# EAGLE design object01 (EAGLE 7.5.0)
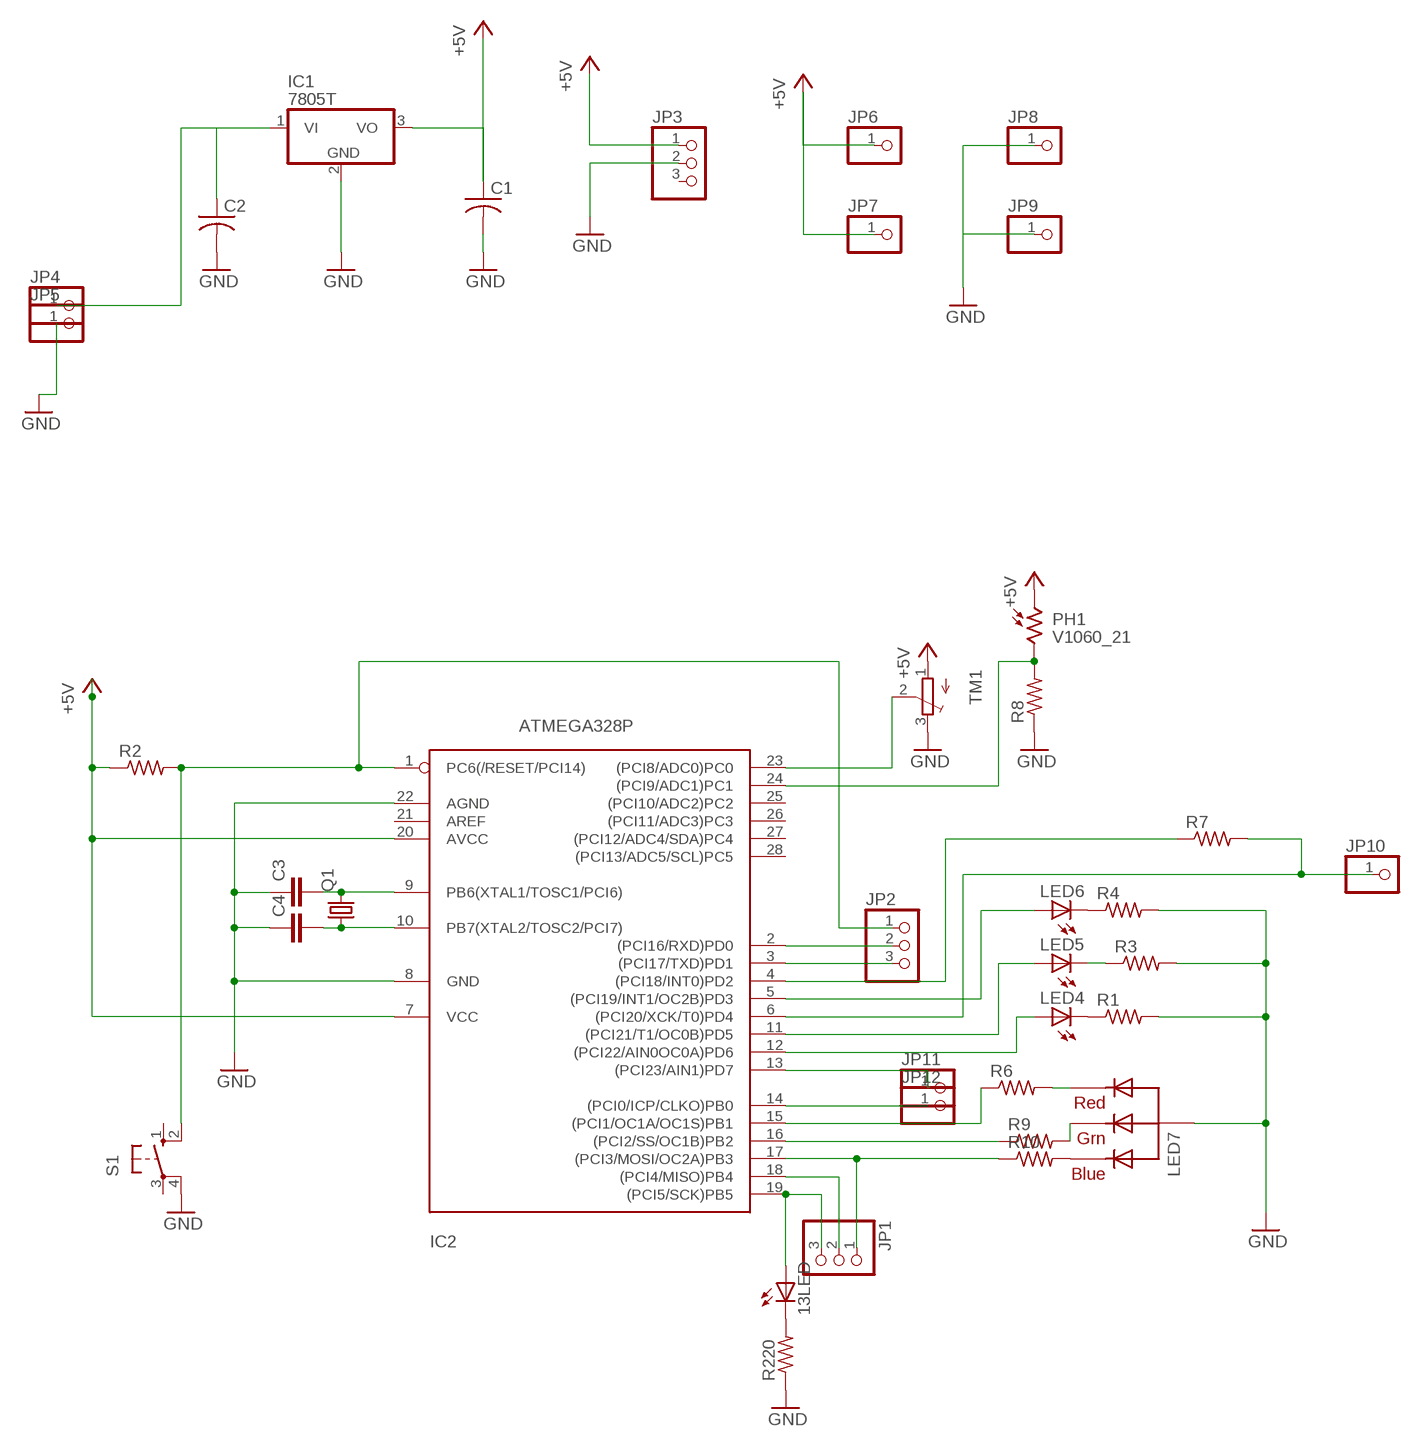
[diagram p0: schematic, sheet 1]

## Parts
13LED  LED5MM  [LED5MM]
C1  C-US050-024X044  [C050-024X044]
C2  C-US050-024X044  [C050-024X044]
C3  C-EU025-024X044  [C025-024X044]
C4  C-EU025-024X044  [C025-024X044]
IC1  7805T  [TO220H]
IC2  ATMEGA328P  [DIL28-3]
JP1  PINHD-1X3CB  [1X03-CLEANBIG]
JP2  PINHD-1X3CB  [1X03-CLEANBIG]
JP3  PINHD-1X3CB  [1X03-CLEANBIG]
JP4  PINHD-1X1  [1X01]
JP5  PINHD-1X1  [1X01]
JP6  PINHD-1X1  [1X01]
JP7  PINHD-1X1  [1X01]
JP8  PINHD-1X1  [1X01]
JP9  PINHD-1X1  [1X01]
JP10  PINHD-1X1  [1X01]
JP11  PINHD-1X1  [1X01]
JP12  PINHD-1X1  [1X01]
LED4  LED5MM  [LED5MM]
LED5  LED5MM  [LED5MM]
LED6  LED5MM  [LED5MM]
LED7  RGBLED_CA-5MM  [LED5MMRGB]
PH1  V1060_21  [TO-5_V10]
Q1  CRYSTALHC49U-V  [HC49U-V]
R1  R-US_0207/10  [0207/10]
R2  R-US_0204/5  [0204/5]
R3  R-US_0207/10  [0207/10]
R4  R-US_0207/10  [0207/10]
R6  R-US_0207/10  [0207/10]
R7  R-US_0207/10  [0207/10]
R8  R-US_0207/10  [0207/10]
R9  R-US_0207/10  [0207/10]
R10  R-US_0207/10  [0207/10]
R220  R-US_0207/10  [0207/10]
S1  10-XX  [B3F-10XX]
TM1  TRIMPOT3386  [TRIM-3386]

## Nets
+5V: C1.1 IC1.3(VO) IC2.7(VCC) IC2.20(AVCC) JP3.1 JP6.1 JP7.1 PH1.1 R2.1 TM1.1(A)
GND: C1.2 C2.2 C3.1 C4.1 IC1.2(GND) IC2.8(GND) IC2.22(AGND) JP3.2 JP5.1 JP8.1 JP9.1 LED7.2(VCC) R1.2 R3.2 R4.2 R8.1 R220.1 S1.4(P1) TM1.3(E)
N$1: C2.1 IC1.1(VI) JP4.1
N$2: C3.2 IC2.9(PB6(XTAL1/TOSC1/PCI6)) Q1.2
N$3: C4.2 IC2.10(PB7(XTAL2/TOSC2/PCI7)) Q1.1
N$4: IC2.17((PCI3/MOSI/OC2A)PB3) JP1.1 R10.1
N$5: IC2.18((PCI4/MISO)PB4) JP1.2
N$6: 13LED.A IC2.19((PCI5/SCK)PB5) JP1.3
N$7: IC2.2((PCI16/RXD)PD0) JP2.2
N$8: IC2.3((PCI17/TXD)PD1) JP2.3
N$9: IC2.1(PC6(/RESET/PCI14)) JP2.1 R2.2 S1.2(S1)
N$10: LED7.1(RED) R6.2
N$11: LED7.3(GREEN) R9.2
N$12: LED5.K(C) R3.1
N$13: LED4.K(C) R1.1
N$14: LED6.K(C) R4.1
N$16: IC2.14((PCI0/ICP/CLKO)PB0) JP12.1
N$17: IC2.5((PCI19/INT1/OC2B)PD3) LED6.A
N$18: IC2.11((PCI21/T1/OC0B)PD5) LED5.A
N$19: IC2.12((PCI22/AIN0OC0A)PD6) LED4.A
N$20: IC2.23((PCI8/ADC0)PC0) TM1.2(S)
N$21: IC2.24((PCI9/ADC1)PC1) PH1.2 R8.2
N$22: IC2.13((PCI23/AIN1)PD7) JP11.1
N$23: IC2.4((PCI18/INT0)PD2) R7.1
N$24: IC2.6((PCI20/XCK/T0)PD4) JP10.1 R7.2
N$25: LED7.4(BLUE) R10.2
N$26: 13LED.K(C) R220.2
N$27: IC2.15((PCI1/OC1A/OC1S)PB1) R6.1
N$28: IC2.16((PCI2/SS/OC1B)PB2) R9.1
Unconnected: IC2.21(AREF) IC2.25((PCI10/ADC2)PC2) IC2.26((PCI11/ADC3)PC3) IC2.27((PCI12/ADC4/SDA)PC4) IC2.28((PCI13/ADC5/SCL)PC5) JP3.3 S1.1(S) S1.3(P)

## Library data of the parts
13LED LED4-LED6 = led:LED: LED OSRAM: - CHIPLED LG R971, LG N971, LY N971, LG Q971, LY Q971, LO R971, LY R971 LH N974, LH R974 LS Q976, LO Q976, LY Q976 LO Q996 - Hyper CHIPLED LW Q18S LB Q993, LB Q99A, LB R99A - SideLED LS A670, LO A670, LY A670, LG A670, LP A670 LB A673, LV A673, LT A673, LW A673 LH A674 LY A675 LS A676, LA A676, LO A676, LY A676, LW A676 LS A679, LY A679, LG A679 - Hyper Micro SIDELED® LS Y876, LA Y876, LO Y876, LY Y876 LT Y87S - SmartLED LW L88C, LW L88S LB L89C, LB L89S, LG L890 LS L89K, LO L89K, LY L89K LS L896, LA L896, LO L896, LY L896 - TOPLED LS T670, LO T670, LY T670, LG T670, LP T670 LSG T670, LSP T670, LSY T670, LOP T670, LYG T670 LG T671, LOG T671, LSG T671 LB T673, LV T673, LT T673, LW T673 LH T674 LS T676, LA T676, LO T676, LY T676, LB T676, LH T676, LSB T676, LW T676 LB T67C, LV T67C, LT T67C, LS T67K, LO T67K, LY T67K, LW E67C LS E67B, LA E67B, LO E67B, LY E67B, LB E67C, LV E67C, LT E67C LW T67C LS T679, LY T679, LG T679 LS T770, LO T770, LY T770, LG T770, LP T770 LB T773, LV T773, LT T773, LW T773 LH T774 LS E675, LA E675, LY E675, LS T675 LS T776, LA T776, LO T776, LY T776, LB T776 LHGB T686 LT T68C, LB T68C - Hyper Mini TOPLED® LB M676 - Mini TOPLED Santana® LG M470 LS M47K, LO M47K, LY M47K Source: http://www.osram.convergy.de LUXEON: - LUMILED® LXK2-PW12-R00, LXK2-PW12-S00, LXK2-PW14-U00, LXK2-PW14-V00 LXK2-PM12-R00, LXK2-PM12-S00, LXK2-PM14-U00 LXK2-PE12-Q00, LXK2-PE12-R00, LXK2-PE12-S00, LXK2-PE14-T00, LXK2-PE14-U00 LXK2-PB12-K00, LXK2-PB12-L00, LXK2-PB12-M00, LXK2-PB14-N00, LXK2-PB14-P00, LXK2-PB14-Q00 LXK2-PR12-L00, LXK2-PR12-M00, LXK2-PR14-Q00, LXK2-PR14-R00 LXK2-PD12-Q00, LXK2-PD12-R00, LXK2-PD12-S00 LXK2-PH12-R00, LXK2-PH12-S00 LXK2-PL12-P00, LXK2-PL12-Q00, LXK2-PL12-R00 Source: www.luxeon.com KINGBRIGHT: KA-3528ASYC Source: www.kingbright.com
C1 C2 = rcl:C-US: CAPACITOR, American symbol
C3 C4 = rcl:C-EU: CAPACITOR, European symbol
IC1 = adafruit:78*: Positive VOLTAGE REGULATOR Added bigger pads to the TO-92 package
IC2 = nanino2:ATMEGA328P
JP1-JP3 = adafruit:PINHD-1X3: PIN HEADER
JP4-JP12 = adafruit:PINHD-1X1: Pin header 1x1 for 0.1" spacing With round pins
LED7 = adafruit:RGBLED_CA: RGB LED, common-anode 5MM Staggered pins 5mm Piranha package http://www.ladyada.net/library/pcb/eaglelibrary.html
PH1 = photo-elements:?1060*: Sensor Street Light control Source: http://optoelectronics.perkinelmer.com/content/Datasheets/DTS_PhotocellsB1060.pdf
Q1 = adafruit:CRYSTAL: CRYSTAL; OC_FARNELL: 1666969; OC_NEWARK: unknown
R1-R4 R6-R10 R220 = resistor:R-US_: RESISTOR, American symbol
S1 = switch-omron:10-XX: OMRON SWITCH; MPN: B3F-1000; OC_FARNELL: 176432; OC_NEWARK: 36M3542
TM1 = adafruit:TRIMPOT: SMT trimmer potentiometer part number TC33X http://www.ladyada.net/library/eagle

## Board
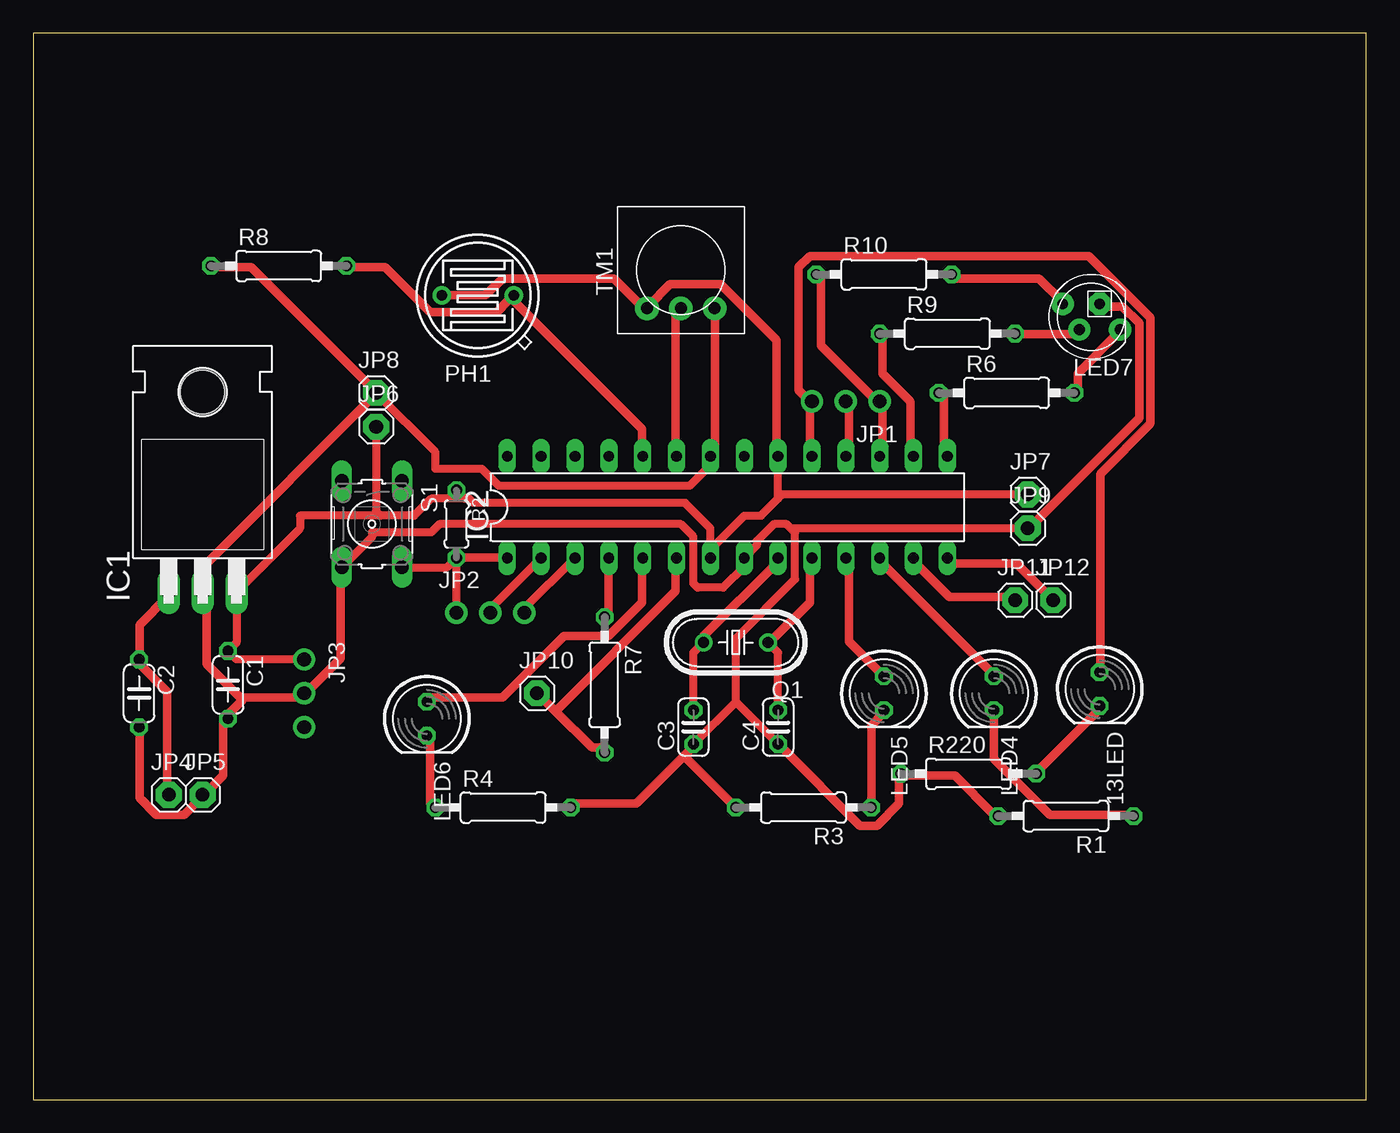
[diagram p1: board, top side]

Size 100 x 80 mm. Coordinates in mm from the lower left corner, seen from the top.
Outline: 0,0 100,0 100,80 0,80 0,0
Copper layers 1: Top 0.035mm
Design rules "default *": minimum track width 25mil, minimum drill 24mil, track to track 8mil, track to pad 8mil, pad to pad 8mil, via to via 8mil, smd to smd 8mil, copper to edge 40mil, drill to drill 12mil, minimum pad ring 10mil, minimum via ring 8mil, stop-mask expansion 4mil, vias tented up to drill 0mil, thermal gap 10mil

### Footprints (pad centres in the part's own frame; a part is rotated, then mirrored left to right if it is on the bottom)
LED5MM = drill 0.813 octagon: A -1.27,0; K 1.27,0
C050-024X044 = drill 0.813 octagon: 1 -2.54,0; 2 2.54,0
C025-024X044 = drill 0.813 octagon: 1 -1.27,0; 2 1.27,0
TO220H = drill 1.118 long: 1 -2.54,-10.16; 2 0,-10.16; 3 2.54,-10.16 | hole 3.302: 0,4.826
DIL28-3 = drill 0.813 long: 1 -16.51,-3.81; 2 -13.97,-3.81; 3 -11.43,-3.81; 4 -8.89,-3.81; 5 -6.35,-3.81; 6 -3.81,-3.81; 7 -1.27,-3.81; 8 1.27,-3.81; 9 3.81,-3.81; 10 6.35,-3.81; 11 8.89,-3.81; 12 11.43,-3.81; 13 13.97,-3.81; 14 16.51,-3.81; 15 16.51,3.81; 16 13.97,3.81; 17 11.43,3.81; 18 8.89,3.81; 19 6.35,3.81; 20 3.81,3.81; 21 1.27,3.81; 22 -1.27,3.81; 23 -3.81,3.81; 24 -6.35,3.81; 25 -8.89,3.81; 26 -11.43,3.81; 27 -13.97,3.81; 28 -16.51,3.81
1X03-CLEANBIG = drill 1.016 pad 1.676: 1 -2.54,0; 2 0,0; 3 2.54,0
1X01 = drill 1.016 pad 1.93 octagon: 1 0,0
LED5MMRGB = drill 0.8 pad 1.676: 1 -2.159,0.968; 3 0.889,0.968; 4 2.159,-0.968 | drill 0.8 pad 1.676 octagon: 2 -0.635,-0.968
TO-5_V10 = drill 0.8 pad 1.4: 1 -2.7,0; 2 2.7,0
HC49U-V = drill 0.813: 1 -2.413,0; 2 2.413,0
0207/10 = drill 0.813 octagon: 1 -5.08,0; 2 5.08,0
0204/5 = drill 0.813 octagon: 1 -2.54,0; 2 2.54,0
B3F-10XX = drill 1.016 long: 1 -3.251,2.261; 2 3.251,2.261; 3 -3.251,-2.261; 4 3.251,-2.261
TRIM-3386 = drill 0.9 pad 1.778: 1 -2.54,-2.857; 2 0,-2.857; 3 2.54,-2.857

### Placement (x,y rotation side)
13LED  80.01,30.8 270 top
C1  14.61,31.11 270 top
C2  7.94,30.48 270 top
C3  49.53,27.94 90 top
C4  55.88,27.94 90 top
IC1  12.7,48.26 0 top
IC2  52.07,44.45 0 top
JP1  60.96,52.39 180 top
JP2  34.29,36.51 0 top
JP3  20.32,30.48 270 top
JP4  10.16,22.86 0 top
JP5  12.7,22.86 0 top
JP6  25.72,50.48 0 top
JP7  74.61,45.4 0 top
JP8  25.72,53.02 0 top
JP9  74.61,42.86 0 top
JP10  37.78,30.48 0 top
JP11  73.66,37.47 0 top
JP12  76.52,37.47 0 top
LED4  72.07,30.48 270 top
LED5  63.82,30.48 270 top
LED6  29.53,28.57 270 top
LED7  79.38,58.74 180 top
PH1  33.34,60.33 0 top
Q1  52.7,34.29 180 top
R1  77.47,21.27 180 top
R2  31.75,43.18 270 top
R3  57.78,21.91 180 top
R4  35.24,21.91 0 top
R6  73.03,53.02 0 top
R7  42.86,31.11 270 top
R8  18.41,62.55 0 top
R9  68.58,57.47 0 top
R10  63.82,61.91 0 top
R220  70.17,24.45 0 top
S1  25.4,43.18 270 top
TM1  48.58,62.23 0 top

### Tracks (layer width: path | path; a pad name or v marks a point on that pad's centre or on a via)
+5V
  Top 0.61: IC2.7 50.8,41.27 | 50.8,41.27 53.34,43.81 54.61,43.81 55.88,45.09 | 55.88,45.09 IC2.20 | 50.8,41.27 50.8,42.86 48.9,44.77 33.02,44.77 32.7,45.09 32.38,45.09 | 32.38,45.09 R2.1 | 32.38,45.09 29.84,45.09 28.57,43.81 26.04,43.81 | 26.04,43.81 20,43.81 20,42.86 IC1.3 15.24,34.29 C1.1 15.24,33.02 JP3.1 | JP6.1 25.72,44.13 26.04,43.81 | JP7.1 56.2,45.4 55.88,45.09
  Top 0.635: 50.71,40.65 IC2.7 | PH1.1 31.01,60.35 33.95,60.35 35.2,61.61 43.59,61.61 45.68,59.51 TM1.1 46.1,59.51 47.78,61.19 51.55,61.19 55.74,57 55.74,48.62 IC2.20
GND
  Top 0.61: IC2.22 50.8,47.62 49.21,46.04 34.92,46.04 33.66,47.31 30.16,47.31 30.16,48.58 JP8.1 | JP3.2 20.32,30.16 | C3.1 52.7,29.84 | 52.7,29.84 52.7,34.61 57.15,39.05 57.15,42.55 56.83,42.86 | S1.4 25.4,42.19 25.4,42.55 29.84,42.55 30.48,43.18 48.58,43.18 49.53,42.23 49.53,38.73 49.85,38.42 51.75,38.42 53.34,40.01 IC2.8 54.29,41.59 54.29,41.91 55.56,43.18 56.52,43.18 56.83,42.86 | C4.1 52.7,29.84 | JP9.1 56.83,42.86
  Top 0.635: 15.72,29.97 14.67,28.92 C1.2 14.25,28.5 14.25,24.31 12.99,23.05 JP5.1 12.57,22.63 11.32,21.37 9.22,21.37 7.96,22.63 7.96,27.66 C2.2 | 15.72,29.97 15.93,30.18 20.12,30.18 JP3.2 20.54,30.59 23.05,33.11 23.05,39.81 S1.4 | 15.72,29.97 12.99,32.69 12.99,37.72 IC1.2 12.99,38.14 12.99,40.23 25.57,52.81 JP8.1 25.57,53.23 16.34,62.45 13.41,62.45 R8.1 | R1.2 72.08,21.37 69.15,24.31 65.38,24.31 R220.1 64.96,24.31 64.96,22.21 63.28,20.54 62.03,20.54 56.16,26.4 C4.1 | 48.83,25.77 49.45,26.4 C3.1 | 48.83,25.77 45.26,22.21 40.65,22.21 R4.2 | 48.83,25.77 52.39,22.21 R3.2 | TM1.3 51.13,59.09 51.13,48.62 IC2.22 | LED7.2 80.05,59.51 81.72,59.51 82.98,58.26 82.98,51.13 75.02,43.17 JP9.1
N$1
  Top 0.635: IC1.1 10.06,37.72 7.96,35.62 7.96,33.11 C2.1 7.96,32.69 10.06,30.59 10.06,23.05 JP4.1
N$2
  Top 0.61: C3.2 49.53,33.53 Q1.2
  Top 0.635: Q1.2 50.29,34.78 55.74,40.23 IC2.9
N$3
  Top 0.61: C4.2 55.88,33.53 Q1.1
  Top 0.635: IC2.10 58.26,40.23 58.26,37.3 55.32,34.37 Q1.1
N$4
  Top 0.635: IC2.17 63.7,48.62 63.7,52.39 JP1.1 63.28,52.39 59.09,56.58 59.09,61.61 R10.1
N$5
  Top 0.635: IC2.18 61.19,48.62 61.19,52.39 JP1.2
N$6
  Top 0.635: 58.26,52.39 58.26,48.62 IC2.19 | 58.26,52.39 57.42,53.23 57.42,62.45 58.26,63.28 79.21,63.28 83.82,58.67 83.82,50.71 80.05,46.94 80.05,32.27 13LED.A | 58.26,52.39 JP1.3
N$7
  Top 0.61: JP2.2 34.29,36.83 IC2.2
N$8
  Top 0.61: JP2.3 36.83,36.83 IC2.3
N$9
  Top 0.61: JP2.1 R2.2 31.04,39.93 S1.2
  Top 0.635: IC2.1 35.2,40.65 31.85,40.65 R2.2
N$10
  Top 0.635: R6.2 78.37,53.23 78.37,54.48 81.31,57.42 LED7.1
N$11
  Top 0.635: R9.2 73.76,57.42 78.37,57.42 LED7.3
N$12
  Top 0.635: R3.1 62.87,28.08 63.7,28.92 LED5.K
N$13
  Top 0.635: R1.1 82.14,21.37 76.28,21.37 72.08,25.57 72.08,28.92 LED4.K
N$14
  Top 0.635: LED6.K 29.76,27.24 29.76,22.21 R4.1
N$16
  Top 0.635: IC2.14 68.73,40.23 73.76,40.23 76.28,37.72 JP12.1
N$17
  Top 0.635: LED6.A 29.76,30.18 35.2,30.18 39.81,34.78 43.17,34.78 45.68,37.3 45.68,40.23 IC2.5
N$18
  Top 0.635: IC2.11 61.19,40.23 61.19,34.37 63.7,31.85 LED5.A
N$19
  Top 0.635: IC2.12 63.7,40.23 72.08,31.85 LED4.A
N$20
  Top 0.635: IC2.23 48.2,48.62 48.2,59.09 TM1.2
N$21
  Top 0.635: IC2.24 45.68,48.62 45.68,50.29 36.04,59.93 PH1.2 35.62,59.93 34.78,59.09 29.76,59.09 26.4,62.45 23.89,62.45 R8.2
N$22
  Top 0.635: IC2.13 66.22,40.23 68.73,37.72 73.34,37.72 JP11.1
N$23
  Top 0.635: R7.1 43.17,36.46 43.17,40.23 IC2.4
N$24
  Top 0.635: 39.19,29.13 38.14,30.18 JP10.1 | 39.19,29.13 41.91,26.4 42.75,26.4 R7.2 | 39.19,29.13 48.2,38.14 48.2,40.23 IC2.6
N$25
  Top 0.635: R10.2 69.15,61.61 75.44,61.61 77.11,59.93 LED7.4
N$26
  Top 0.635: R220.2 75.44,24.73 80.05,29.34 13LED.K
N$27
  Top 0.635: IC2.15 68.31,48.62 68.31,52.81 R6.1
N$28
  Top 0.635: R9.1 63.7,57.42 63.7,54.48 65.8,52.39 65.8,48.62 IC2.16